# EAGLE design usbTerminal (EAGLE 9.6.2)
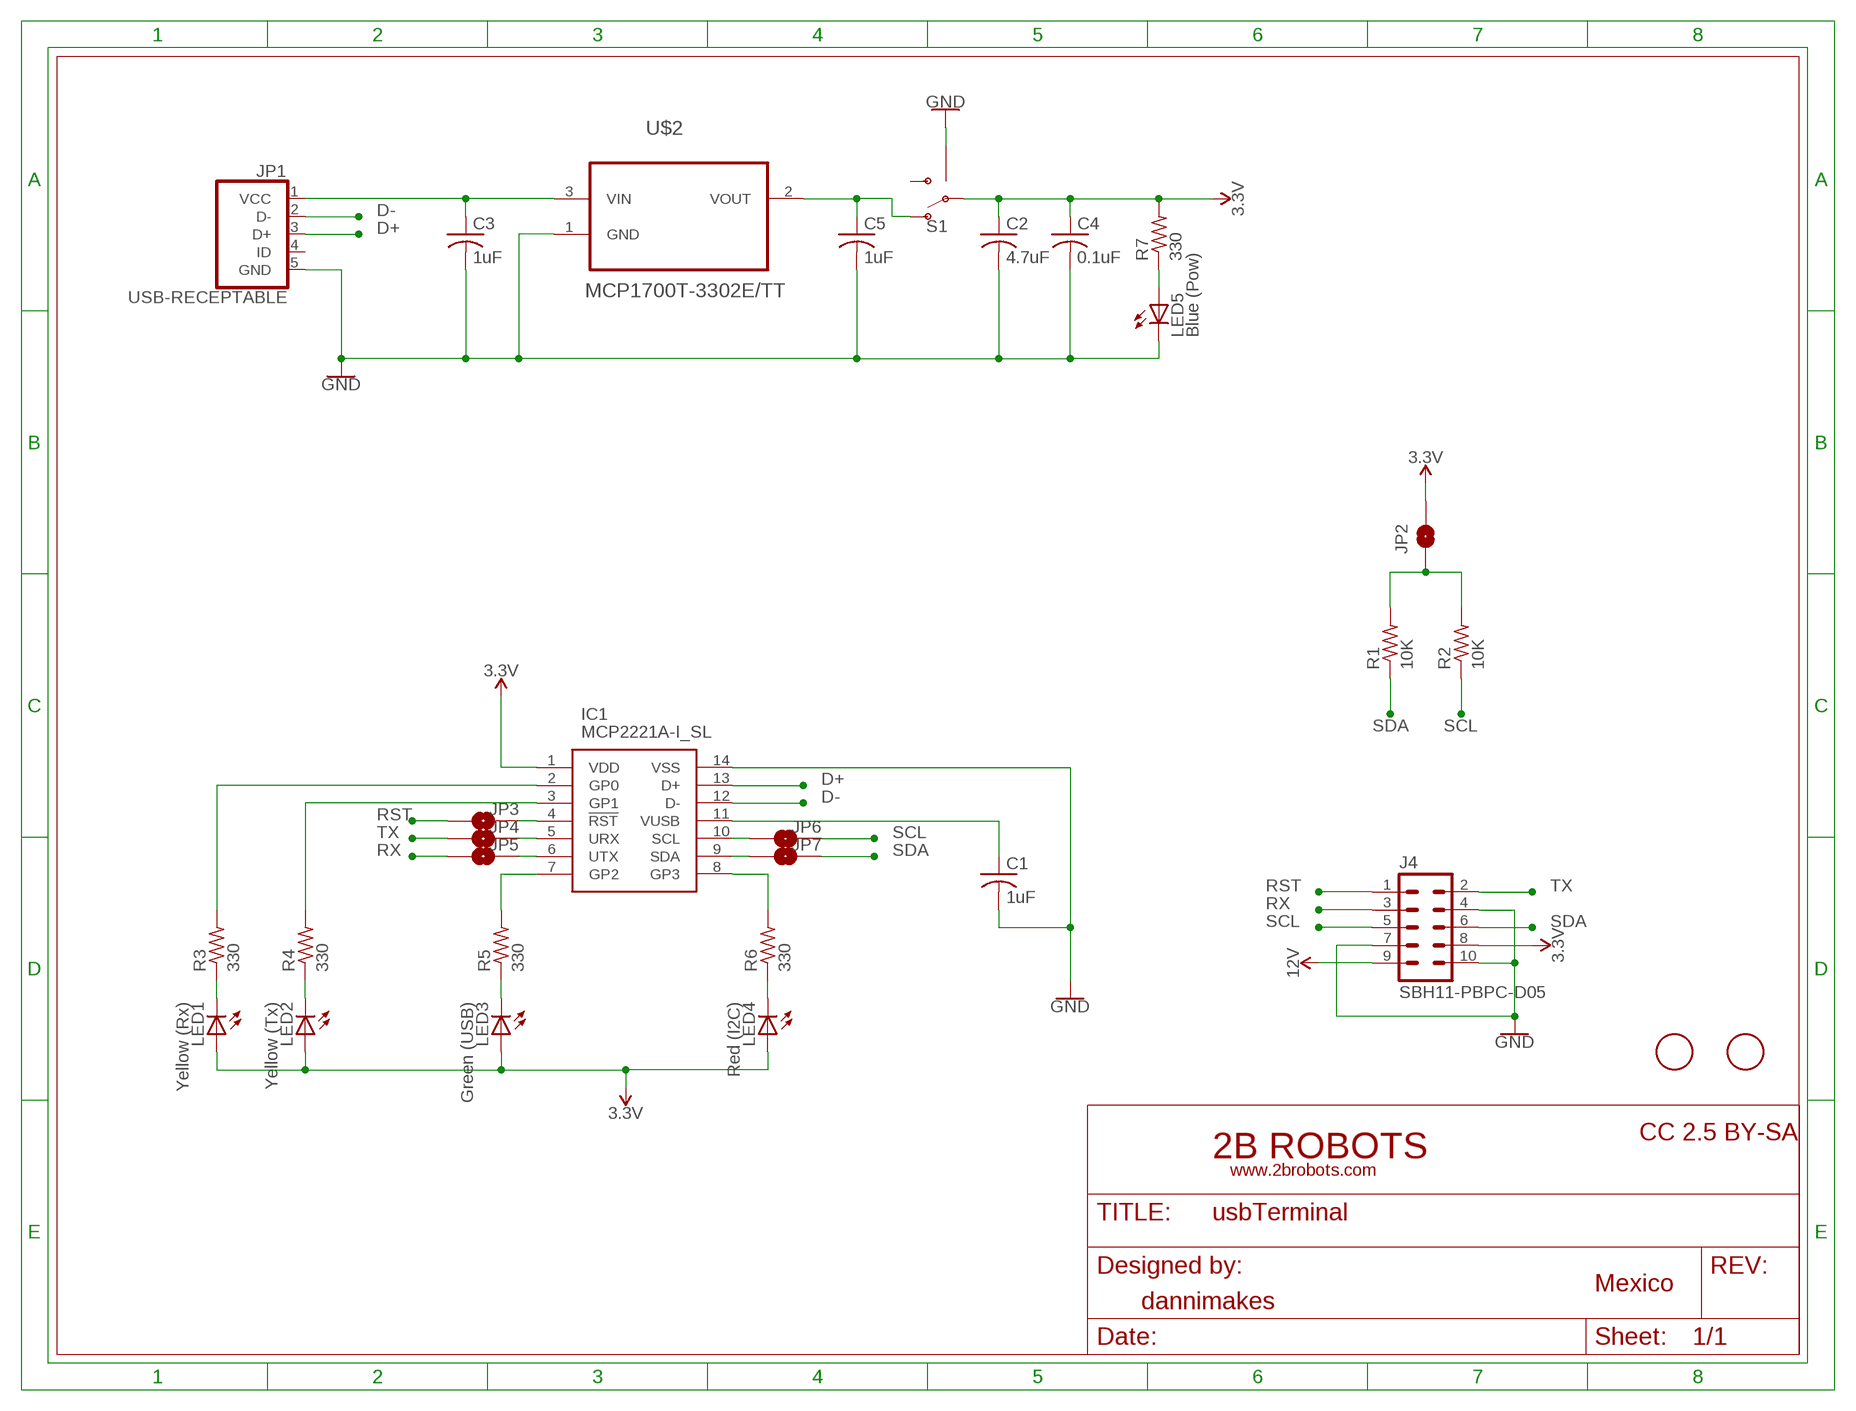
[diagram p0: schematic, sheet 1]

## Parts
C1  1uF  C-USC0603K  [C0603K]
C2  4.7uF  C-USC0805K  [C0805K]
C3  1uF  C-USC0603K  [C0603K]
C4  0.1uF  C-USC0603K  [C0603K]
C5  1uF  C-USC0603K  [C0603K]
IC1  MCP2221A-I_SL  [SOIC127P600X175-14N]
J4  SBH11-PBPC-D05  [SBH11-PBPC-D05]
JP1  USB-RECEPTABLE  [FCI-10103594-0001LF]
JP2  JUMPER-SMT_2_NO_SILK  [SMT-JUMPER_2_NO_SILK]
JP3  JUMPER-SMT_2_NO_SILK  [SMT-JUMPER_2_NO_SILK]
JP4  JUMPER-SMT_2_NO_SILK  [SMT-JUMPER_2_NO_SILK]
JP5  JUMPER-SMT_2_NO_SILK  [SMT-JUMPER_2_NO_SILK]
JP6  JUMPER-SMT_2_NO_SILK  [SMT-JUMPER_2_NO_SILK]
JP7  JUMPER-SMT_2_NO_SILK  [SMT-JUMPER_2_NO_SILK]
LED1  Yellow (Rx)  LEDCHIPLED_1206  [CHIPLED_1206]
LED2  Yellow (Tx)  LEDCHIPLED_1206  [CHIPLED_1206]
LED3  Green (USB)  LEDCHIPLED_1206  [CHIPLED_1206]
LED4  Red (I2C)  LEDCHIPLED_1206  [CHIPLED_1206]
LED5  Blue (Pow)  LEDCHIPLED_1206  [CHIPLED_1206]
R1  10K  R-US_R0805  [R0805]
R2  10K  R-US_R0805  [R0805]
R3  330  R-US_R0805  [R0805]
R4  330  R-US_R0805  [R0805]
R5  330  R-US_R0805  [R0805]
R6  330  R-US_R0805  [R0805]
R7  330  R-US_R0805  [R0805]
S1  SWITCH-SPDT-SMD-RIGHT-ANGLE  [SWITCH_SPST_SMD_A]
U$1  FIDUCIAL  [FIDUCIAL_1MM]
U$2  MCP1700T-3302E/TT  [SOT95P237X112-3N]
U$3  FIDUCIAL  [FIDUCIAL_1MM]

## Nets
3.3V: C2.1 C4.1 IC1.1(VDD) J4.8 JP2.2 LED1.A LED2.A LED3.A LED4.A R7.2 S1.2(P)
12V: J4.9
D+: IC1.13(D+) JP1.3(D+)
D-: IC1.12(D-) JP1.2(D-)
GND: C1.2 C2.2 C3.2 C4.2 C5.2 IC1.14(VSS) J4.4 J4.7 J4.10 JP1.5(GND) LED5.C S1.GND1(GND) S1.GND2(GND) S1.GND3(GND) S1.GND4(GND) U$2.1(GND)
N$4: IC1.4(!RST) JP3.1
N$6: C1.1 IC1.11(VUSB)
N$7: IC1.5(URX) JP4.1
N$8: JP2.1 R1.2 R2.2
N$9: IC1.6(UTX) JP5.1
N$10: IC1.10(SCL) JP6.2
N$11: IC1.9(SDA) JP7.2
N$12: LED1.C R3.1
N$13: LED2.C R4.1
N$14: LED3.C R5.1
N$15: LED4.C R6.1
N$16: C3.1 JP1.1(VCC) U$2.3(VIN)
N$17: LED5.A R7.1
N$18: IC1.7(GP2) R5.2
N$19: IC1.8(GP3) R6.2
N$20: IC1.3(GP1) R4.2
N$21: IC1.2(GP0) R3.2
N$22: C5.1 S1.1(O) U$2.2(VOUT)
RST: J4.1 JP3.2
RX: J4.3 JP5.2
SCL: J4.5 JP6.1 R2.1
SDA: J4.6 JP7.1 R1.1
TX: J4.2 JP4.2
Unconnected: JP1.4(ID) S1.3(S)

## Library data of the parts
C1-C5 = adafruit:C-US: CAPACITOR, American symbol
IC1 = SamacSys_Parts:MCP2221A-I_SL: USB Interface IC USB 2.0 to I2C Converter with GPIO Source: Datasheet <https://componentsearchengine.com/Datasheets/1/MCP2221A-I_SL.pdf>; DESCRIPTION: USB Interface IC USB 2.0 to I2C Converter with GPIO; HEIGHT: 1.75mm; MANUFACTURER_NAME: Microchip; MANUFACTURER_PART_NUMBER: MCP2221A-I/SL; MOUSER_PART_NUMBER: 579-MCP2221A-I/SL; MOUSER_PRICE-STOCK: https://www.mouser.com/Search/Refine.aspx?Keyword=579-MCP2221A-I%2FSL
J4 = con-sullins:SBH11-PBPC-D05: HEADER - Vertical, Shrouded
JP1 = daspilker:USB-RECEPTABLE: USB Receptable
JP2-JP7 = SparkFun-Jumpers:JUMPER-SMT_2_NO: Normally open jumper This jumper has two pads in close proximity to each other. Apply solder to close the connection. Round pads are easier to solder for beginners, but are a lot larger. SparkFun Product that uses the round pads: SparkFun EL Sequencer <https://www.sparkfun.com/products/12781>
LED1-LED5 = adafruit:LED: LED OSRAM: - CHIPLED LG R971, LG N971, LY N971, LG Q971, LY Q971, LO R971, LY R971 LH N974, LH R974 LS Q976, LO Q976, LY Q976 LO Q996 - Hyper CHIPLED LW Q18S LB Q993, LB Q99A, LB R99A - SideLED LS A670, LO A670, LY A670, LG A670, LP A670 LB A673, LV A673, LT A673, LW A673 LH A674 LY A675 LS A676, LA A676, LO A676, LY A676, LW A676 LS A679, LY A679, LG A679 - Hyper Micro SIDELED® LS Y876, LA Y876, LO Y876, LY Y876 LT Y87S - SmartLED LW L88C, LW L88S LB L89C, LB L89S, LG L890 LS L89K, LO L89K, LY L89K LS L896, LA L896, LO L896, LY L896 - TOPLED LS T670, LO T670, LY T670, LG T670, LP T670 LSG T670, LSP T670, LSY T670, LOP T670, LYG T670 LG T671, LOG T671, LSG T671 LB T673, LV T673, LT T673, LW T673 LH T674 LS T676, LA T676, LO T676, LY T676, LB T676, LH T676, LSB T676, LW T676 LB T67C, LV T67C, LT T67C, LS T67K, LO T67K, LY T67K, LW E67C LS E67B, LA E67B, LO E67B, LY E67B, LB E67C, LV E67C, LT E67C LW T67C LS T679, LY T679, LG T679 LS T770, LO T770, LY T770, LG T770, LP T770 LB T773, LV T773, LT T773, LW T773 LH T774 LS E675, LA E675, LY E675, LS T675 LS T776, LA T776, LO T776, LY T776, LB T776 LHGB T686 LT T68C, LB T68C - Hyper Mini TOPLED® LB M676 - Mini TOPLED Santana® LG M470 LS M47K, LO M47K, LY M47K Source: http://www.osram.convergy.de/
R1-R7 = adafruit:R-US_: RESISTOR, American symbol
S1 = SparkFun-Switches:SWITCH-SPDT: Single Pole, Double Throw (SPDT) Switch Single-pole, double-throw (SPDT) switch. Variant Overview SMD-AYZ0202 Surface Mount DPDT Switch <https://www.sparkfun.com/products/597> (COM-00597) Used on e.g. LilyPad Arduino USB - ATmega32U4 Board <https://www.sparkfun.com/products/12049> PTH-11.6X4.0MM SPDT Mini Power Switch <https://www.sparkfun.com/products/102> (COM-00102) Used on e.g. SparkFun Simon Says - Through-Hole Soldering Kit <https://www.sparkfun.com/products/10547> (KIT-10547) PTH-11.6X4.0MM-KIT KIT version of SPDT Mini Power Switch - Simplifies soldering by removing tStop of switch pins - only one side can be soldered. PTH-11.6X4.0MM-LOCK LOCK version of SPDT Mini Power Switch - Offset pins hold switch in place for easier soldering. SMD-RIGHT-ANGLE Surface Mount Right Angle Switch <https://www.sparkfun.com/products/10860> (COM-10860) Used on e.g. SparkFun ESP8266 Thing <https://www.sparkfun.com/products/13231>; PROD_ID: SWCH-10651; SF_SKU: COM-10860
U$1 U$3 = adafruit:FIDUCIAL: For use by pick and place machines to calibrate the vision/machine, 1mm By microbuilder.eu
U$2 = MCP1700T-3302E:MCP1700T-3302E/TT: Low Quiescent Current LDO; MPN: MCP1700T-3302E/TT; OC_FARNELL: 1296592; OC_NEWARK: 88H9817; PACKAGE: SOT23-3; SUPPLIER: Microchip

## Board
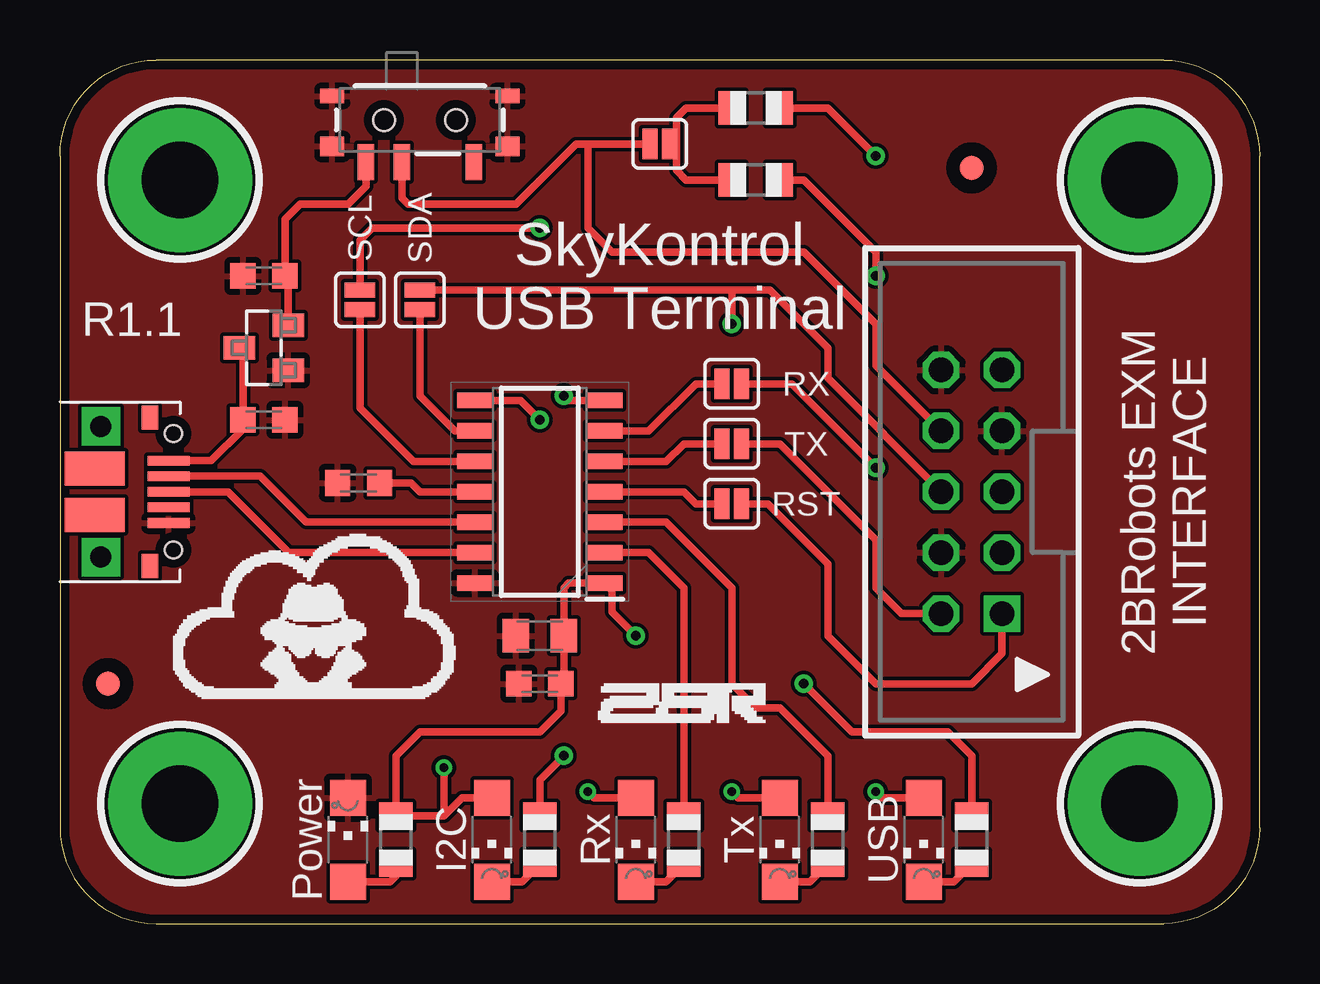
[diagram p1: board, top side]
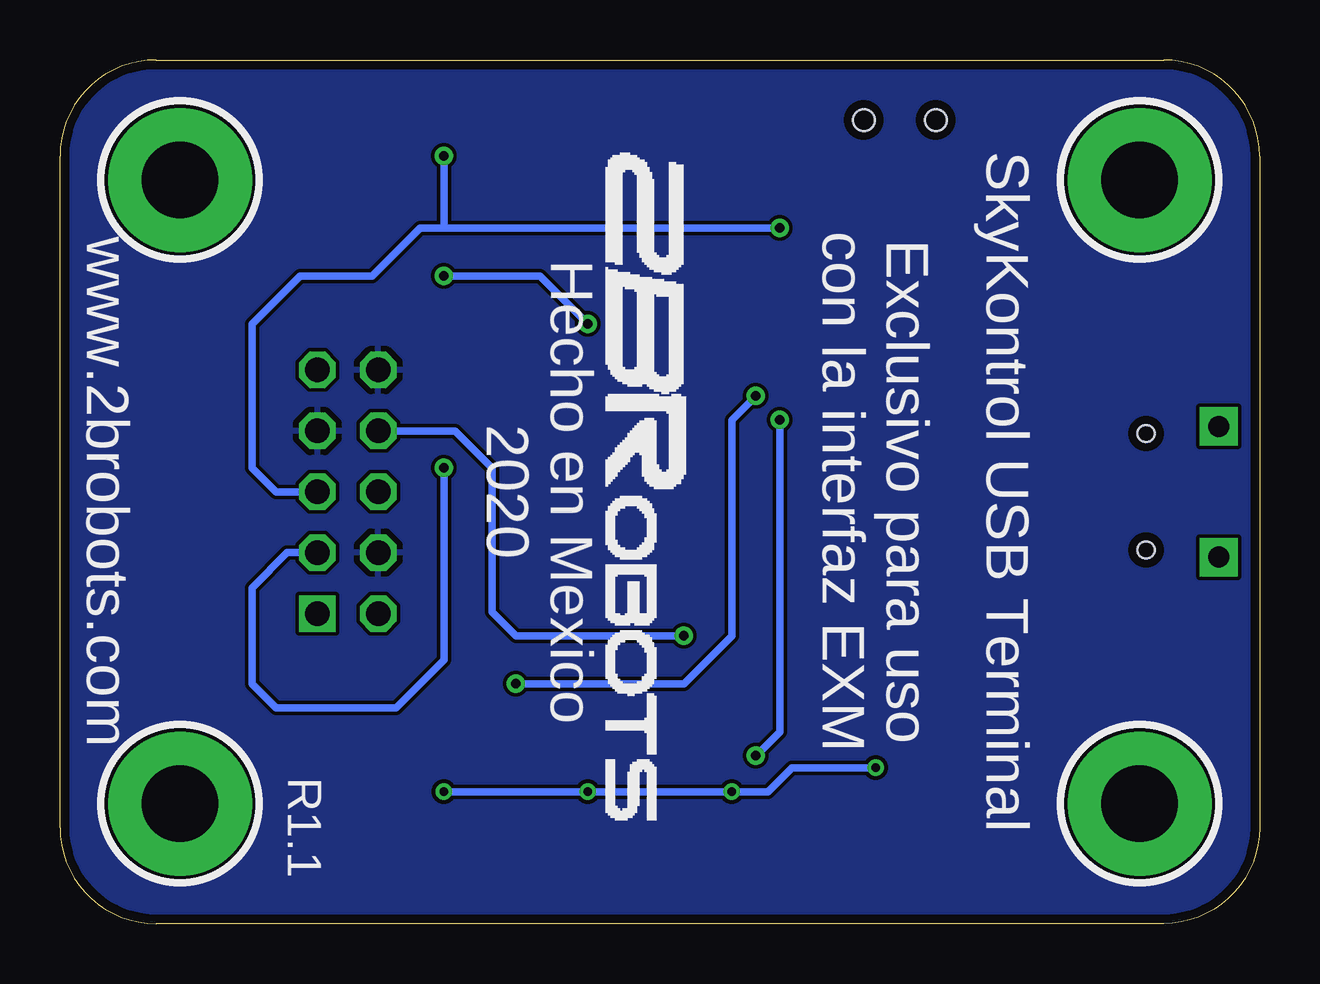
[diagram p2: board, bottom side, seen from below]

Size 50 x 36 mm. Coordinates in mm from the lower left corner, seen from the top.
Outline: 4,0 46,0 arc90 50,4 50,32 arc90 46,36 4,36 arc90 0,32 0,4 arc90 4,0
Copper layers (1*16): Top 0.0356mm / dielectric 1.5011mm / Bottom 0.0356mm
Design rules "2brobots-2layer": minimum track width 6mil, minimum drill 0.3mm, track to track 6mil, track to pad 6mil, pad to pad 6mil, via to via 6mil, smd to smd 6mil, copper to edge 15mil, drill to drill 6mil, minimum pad ring 7mil, minimum via ring 7mil, stop-mask expansion 2.5mil, vias tented up to drill 50mil, thermal gap 10mil

### Footprints (pad centres in the part's own frame; a part is rotated, then mirrored left to right if it is on the bottom)
C0603K = smd 1.05 x 1.08: 1 -0.875,0; 2 0.875,0
C0805K = smd 1.1 x 1.4: 1 -1,0; 2 1,0
SOIC127P600X175-14N = smd 1.5 x 0.65: 1 -2.7,3.81; 2 -2.7,2.54; 3 -2.7,1.27; 4 -2.7,0; 5 -2.7,-1.27; 6 -2.7,-2.54; 7 -2.7,-3.81; 8 2.7,-3.81; 9 2.7,-2.54; 10 2.7,-1.27; 11 2.7,0; 12 2.7,1.27; 13 2.7,2.54; 14 2.7,3.81
SBH11-PBPC-D05 = drill 1.016 square: 1 -5.08,-1.27 | drill 1.016 octagon: 2 -5.08,1.27; 3 -2.54,-1.27; 4 -2.54,1.27; 5 0,-1.27; 6 0,1.27; 7 2.54,-1.27; 8 2.54,1.27; 9 5.08,-1.27; 10 5.08,1.27
FCI-10103594-0001LF = smd 0.4 x 1.75: 1 -1.3,4.525; 2 -0.65,4.525; 3 0,4.525; 4 0.65,4.525; 5 1.3,4.525 | smd 1 x 0.7: P$1 3.1,3.75; P$6 -3.1,3.75 | smd 1.425 x 2.5: P$2 0.963,1.45; P$5 -0.963,1.45 | drill 0.88 pad 1.6 square: P$3 -2.725,1.7; P$4 2.725,1.7 | hole 0.7: -2.425,4.73; 2.425,4.73
SMT-JUMPER_2_NO_SILK = smd 0.635 x 1.27: 1 -0.406,0; 2 0.406,0
CHIPLED_1206 = smd 1.5 x 1.5: A 0,-1.75; C 0,1.75
R0805 = smd 1.1 x 1.4: 1 -1,0; 2 1,0
SWITCH_SPST_SMD_A = smd 0.7 x 1.5: 1 -2.25,-1.75; 2 -0.75,-1.75; 3 2.25,-1.75 | smd 1 x 0.6: GND1 -3.65,1; GND3 3.65,1 | smd 1 x 0.8: GND2 -3.65,-1.1; GND4 3.65,-1.1 | hole 0.9: -1.5,0; 1.5,0
FIDUCIAL_1MM = smd 1 x 1: 1 0,0
SOT95P237X112-3N = smd 0.991 x 1.321: 1 -0.94,-1.016; 2 0.94,-1.016; 3 0,1.016

### Placement (x,y rotation side)
C1  12.45,18.37 180 top
C2  20,12 180 top
C3  8.5,21 0 top
C4  20,10 180 top
C5  8.5,27 180 top
IC1  20,18 180 top
J4  38,18 90 top
JP1  0,18 270 top
JP2  25,32.5 180 top
JP3  28,17.5 0 top
JP4  28,20 0 top
JP5  28,22.5 0 top
JP6  12.5,26 270 top
JP7  15,26 270 top
LED1  24,3.5 180 top
LED2  30,3.5 180 top
LED3  36,3.5 180 top
LED4  18,3.5 180 top
LED5  12,3.5 0 top
R1  29,31 180 top
R2  29,34 180 top
R3  26,3.5 90 top
R4  32,3.5 90 top
R5  38,3.5 90 top
R6  20,3.5 90 top
R7  14,3.5 90 top
S1  15,33.5 0 top
U$1  2,10 0 top
U$2  8.5,24 90 top
U$3  38,31.5 0 top

### Tracks (layer width: path | path; a pad name or v marks a point on that pad's centre or on a via)
3.3V  (via drill 0.35, 0.4)
  Top 0.305: 22,32.5 JP2.2 | v24,12 23,13 23,13.89 IC1.1 21.19,14.19 21,14 C2.1 21,10.12 C4.1 20.88,8.88 20,8 15,8 14,7 R7.2 16,4.5 | J4.8 34,23.27 34,25 31,28 23,28 22,29 22,32.5 | 16,4.5 16.75,5.25 LED4.A | 16,4.5 v16,6.5 | v34,5.5 34.25,5.25 LED3.A | v22,5.5 22.25,5.25 LED1.A | v28,5.5 28.25,5.25 LED2.A | S1.2 14.25,30.25 14.5,30 19,30 21.5,32.5 22,32.5
  Bottom 0.305: J4.8 33.54,20.54 32,19 32,13 31,12 v24,12 | v16,6.5 19.5,6.5 20.5,5.5 v22,5.5 v28,5.5 v34,5.5
D+
  Top 0.305: JP1.3 7,18 9.54,15.46 IC1.13
D-
  Top 0.305: JP1.2 8.35,18.65 10.27,16.73 IC1.12
GND
  pour Top: 0,0 50,0 50,36 0,36
  pour Bottom: 0,0 50,0 50,36 0,36
N$1  (via drill 3.2 pad 6)
  other vias: 5,31
N$2  (via drill 3.2 pad 6)
  other vias: 5,5
N$3  (via drill 3.2 pad 6)
  other vias: 45,5
N$4
  Top 0.305: IC1.4 26,18 26.5,17.5 JP3.1
N$5  (via drill 3.2 pad 6)
  other vias: 45,31
N$6
  Top 0.305: C1.1 14.63,18.37 15,18 IC1.11
N$7
  Top 0.305: IC1.5 25.27,19.27 26,20 JP4.1
N$8
  Top 0.305: 25.7,32.5 JP2.1 | R1.2 26.1,31 25.7,31.4 25.7,32.5 | 25.7,32.5 25.7,33.6 26.1,34 R2.2
N$9
  Top 0.305: IC1.6 24.54,20.54 26.5,22.5 JP5.1
N$10
  Top 0.305: IC1.10 14.73,19.27 12.5,21.5 JP6.2
N$11
  Top 0.305: IC1.9 16.46,20.54 15,22 JP7.2
N$12
  Top 0.305: R3.1 25.25,1.75 LED1.C
N$13
  Top 0.305: R4.1 31.25,1.75 LED2.C
N$14
  Top 0.305: R5.1 37.25,1.75 LED3.C
N$15
  Top 0.305: R6.1 19.25,1.75 LED4.C
N$16
  Top 0.305: JP1.1 6.3,19.3 7.62,20.62 C3.1 7.62,23.86 U$2.3
N$17
  Top 0.305: R7.1 14,2 13.75,1.75 LED5.A
N$18  (via drill 0.4)
  Top 0.305: R5.2 38,7 37,8 33,8 v31,10 | IC1.7 21.19,21.81 v21,22
  Bottom 0.305: v31,10 24,10 22,12 22,21 v21,22
N$19  (via drill 0.4)
  Top 0.305: R6.2 20,6 v21,7 | v20,21 19.19,21.81 IC1.8
  Bottom 0.305: v21,7 20,8 v20,21
N$20
  Top 0.305: R4.2 32,7 30,9 29,9 28,10 28,14 25.27,16.73 IC1.3
N$21
  Top 0.305: IC1.2 24.54,15.46 26,14 R3.2
N$22
  Top 0.305: U$2.2 9.52,26.86 C5.1 9.38,29.38 10,30 12,30 12.75,30.75 S1.1
RST
  Top 0.305: JP3.2 29.5,17.5 32,15 32,12 34,10 38,10 39.27,11.27 J4.1
RX  (via drill 0.4)
  Top 0.305: JP5.2 30.5,22.5 v34,19
  Bottom 0.305: v34,19 34,11 36,9 41,9 42,10 42,14 40.54,15.46 J4.3
SCL  (via drill 0.4)
  Top 0.305: JP6.1 12.5,28.5 13,29 v20,29 | R2.1 32,34 v34,32
  Bottom 0.305: v20,29 34,29 | 34,29 35,29 37,27 40,27 42,25 42,19 41,18 J4.5 | v34,32 34,29
SDA  (via drill 0.4)
  Top 0.305: J4.6 32,22.73 32,24 29.59,26.41 28,26.41 | 28,26.41 JP7.1 | R1.1 31,31 34,28 v34,27 | v28,25 28,26.41
  Bottom 0.305: v28,25 30,27 v34,27
TX
  Top 0.305: JP4.2 30,20 34,16 34,14 35.08,12.92 J4.2

### Text on the board
tPlace: SCL | SDA | SkyKontrol / USB Terminal | R1.1 | RX | TX | RST | 2BRobots EXM / INTERFACE | Power | I2C | Rx | Tx | USB
bPlace: SkyKontrol USB Terminal | Exclusivo para uso / con la interfaz EXM | Hecho en Mexico / 2020 | www.2brobots.com | R1.1
tStop: 2brobots.com